# EasyEDA schematic SCH_Czujnik-Wody_2026-02-04.json
TITLE: Sheet_1; REV: 1.0; Date: 2025-08-14; Sheet: 1/1; Drawn By: dom78kow; Company: Your Company
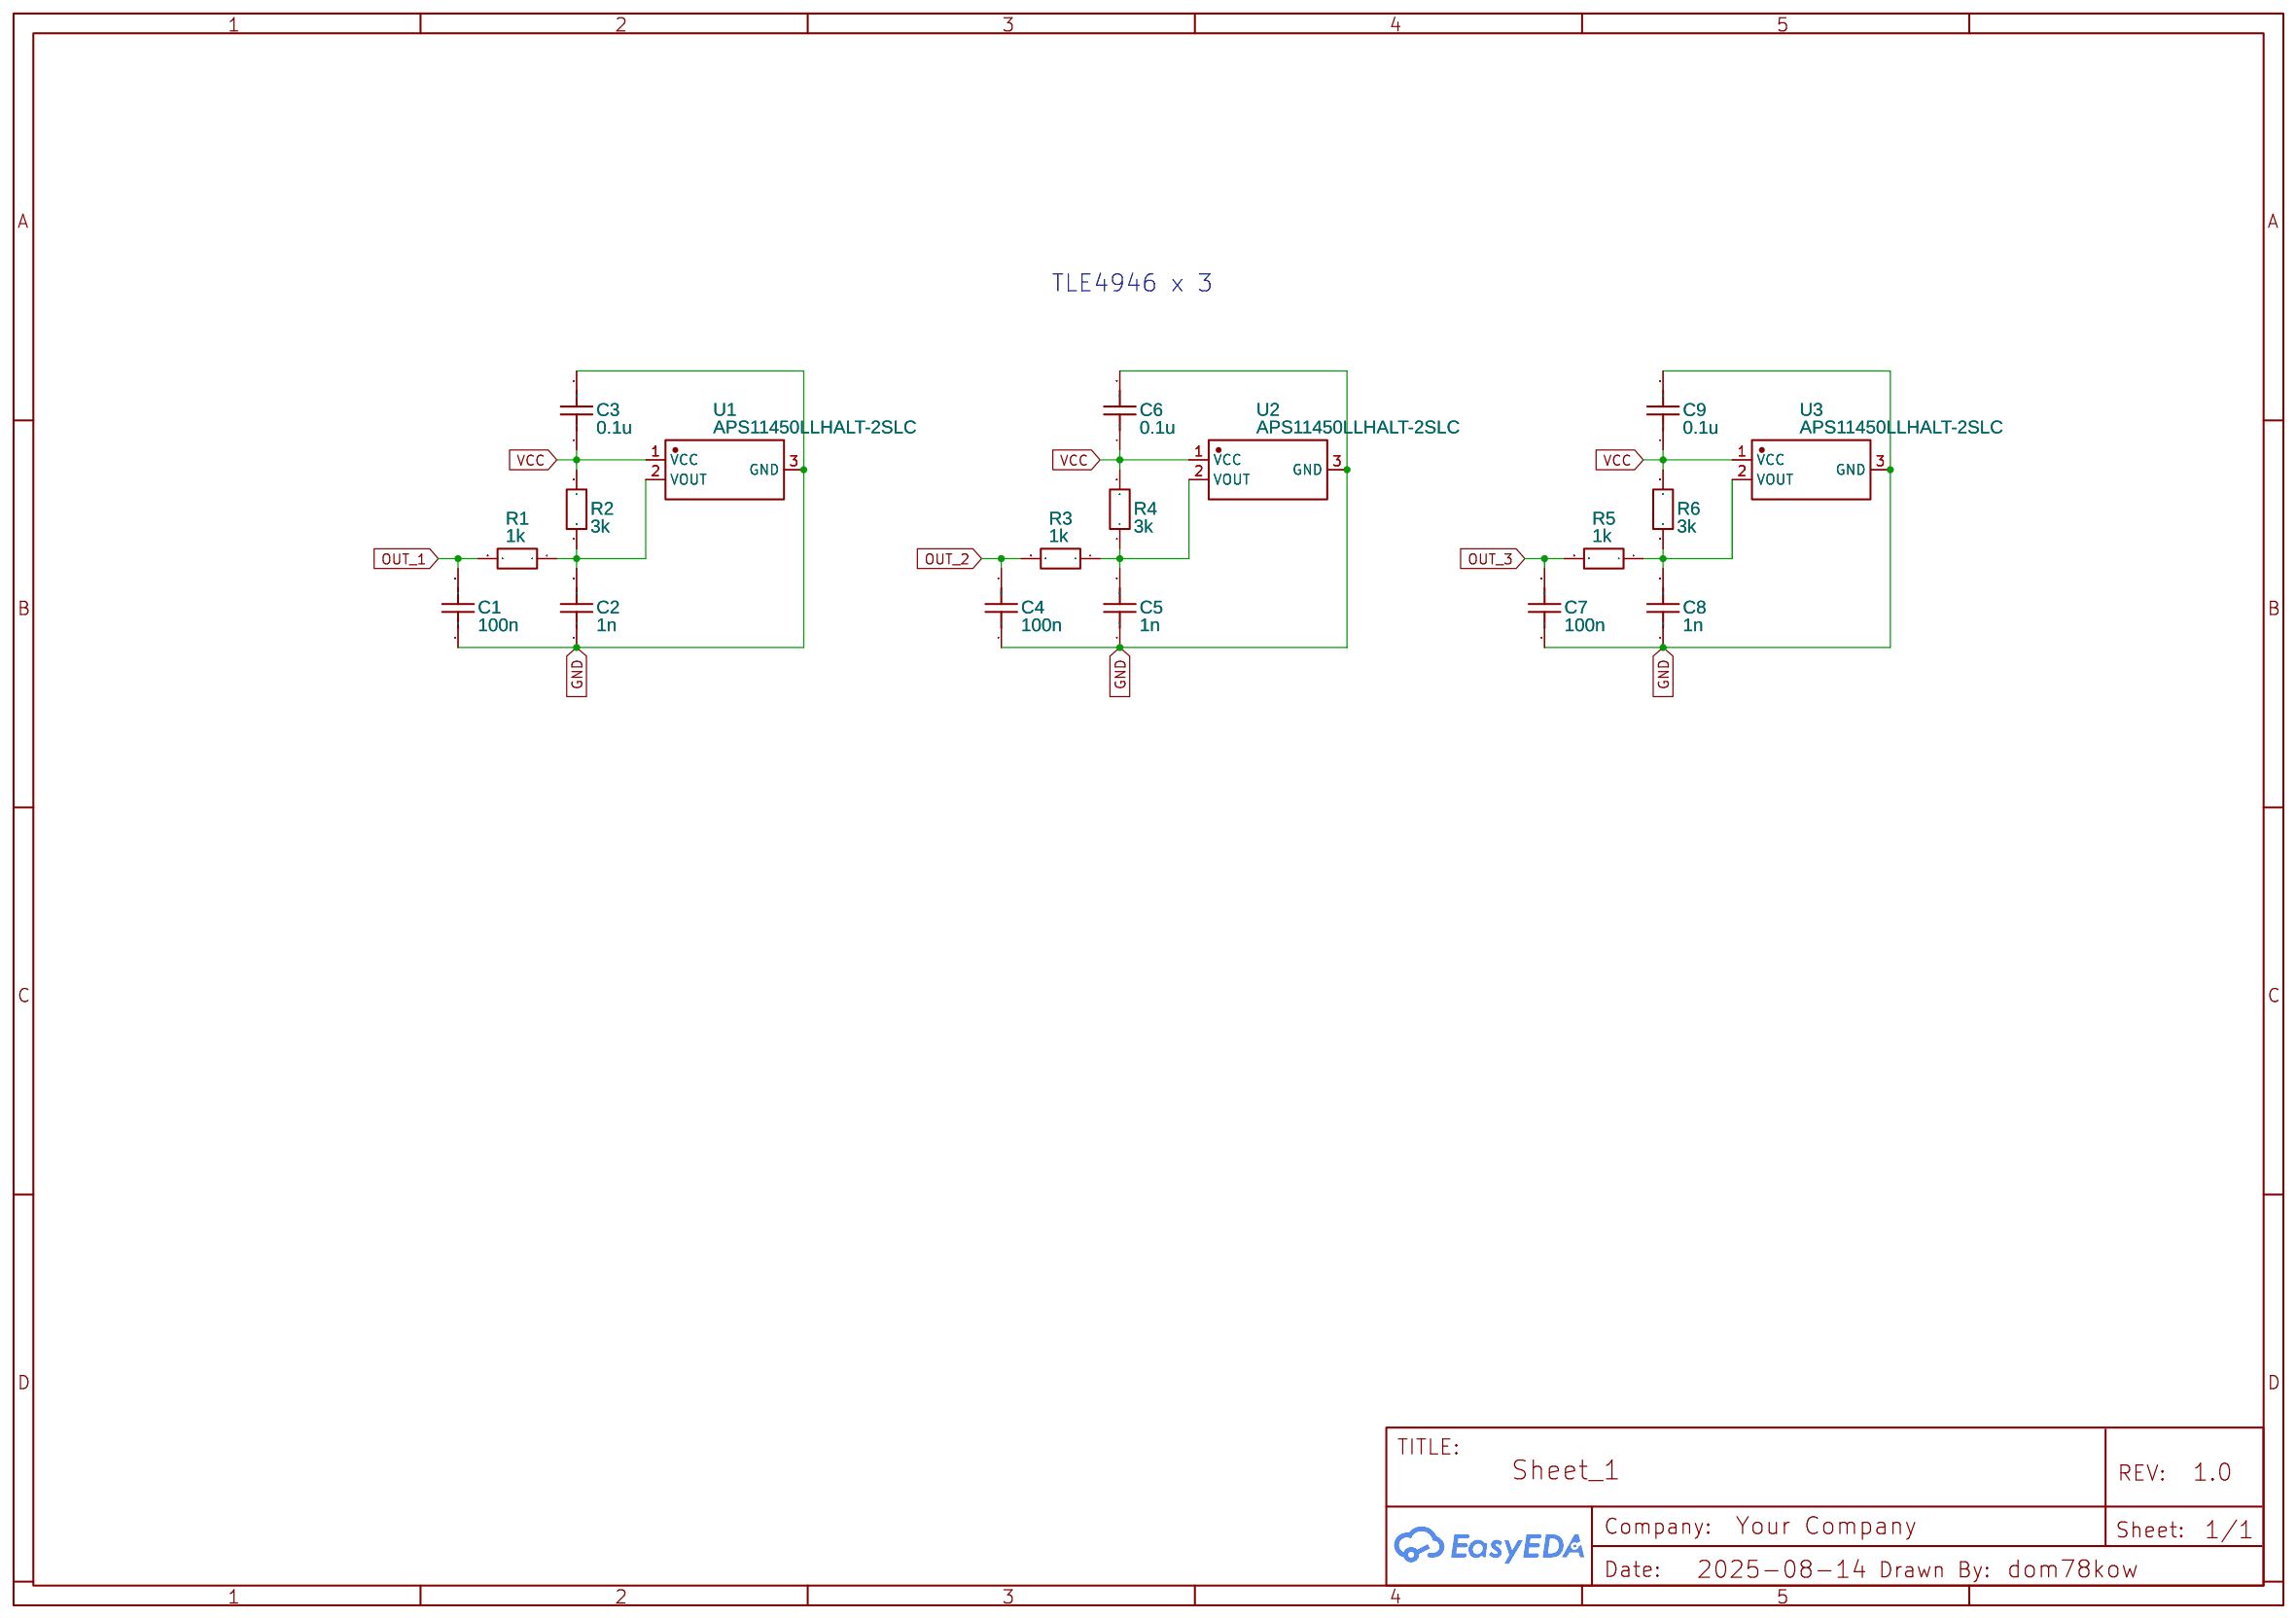
[diagram p0: schematic sheet]

## Parts
C1  100n  [C0805]
C2  1n  [C0805]
C3  0.1u  [C0805]
C4  100n  [C0805]
C5  1n  [C0805]
C6  0.1u  [C0805]
C7  100n  [C0805]
C8  1n  [C0805]
C9  0.1u  [C0805]
R1  1k  [R0805]
R2  3k  [R0805]
R3  1k  [R0805]
R4  3k  [R0805]
R5  1k  [R0805]
R6  3k  [R0805]
U1  APS11450LLHALT-2SLC  [SOT-23W_L3.0-W1.9-P1.90-LS2.9-BR]
U2  APS11450LLHALT-2SLC  [SOT-23W_L3.0-W1.9-P1.90-LS2.9-BR]
U3  APS11450LLHALT-2SLC  [SOT-23W_L3.0-W1.9-P1.90-LS2.9-BR]

## Library data of the parts
C1-C9 = C_0805_US: Contributor: LCEDA_Lib
R1-R6 = R_0805_EU: Contributor: LCEDA_Lib
U1-U3 = APS11450LLHALT-2SLC: Contributor: lcsc; Supplier: LCSC; Supplier Part: C3716240; Manufacturer: ALLEGRO(美国埃戈罗)

## Nets
GND: C1.1 C2.1 C3.2 C4.1 C5.1 C6.2 C7.1 C8.1 C9.2 U1.3(GND) U2.3(GND) U3.3(GND)
VCC: C3.1 C6.1 C9.1 R2.2 R4.2 R6.2 U1.1(VCC) U2.1(VCC) U3.1(VCC)
OUT_1: C1.2 R1.2
OUT_2: C4.2 R3.2
OUT_3: C7.2 R5.2
Net-(C2-2): C2.2 R1.1 R2.1 U1.2(VOUT)
Net-(C5-2): C5.2 R3.1 R4.1 U2.2(VOUT)
Net-(C8-2): C8.2 R5.1 R6.1 U3.2(VOUT)

## Notes on the sheet
- TLE4946 x 3
